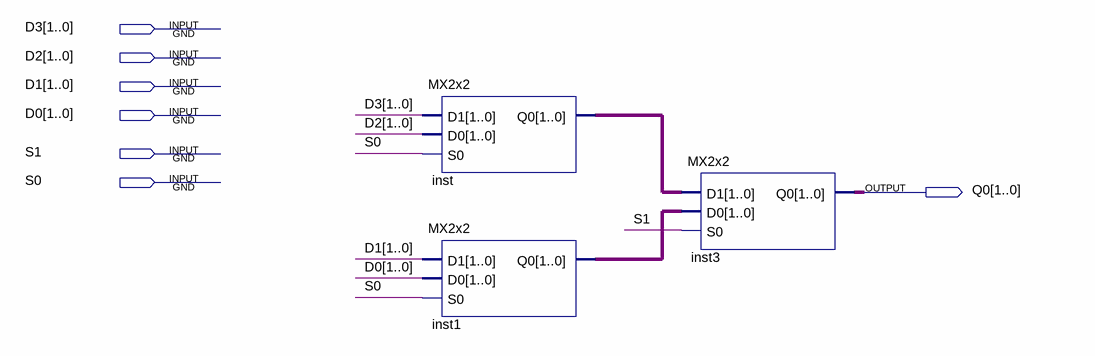
[diagram p0: schematic sheet]
// Quartus schematic MX4x2.bdf as structural Verilog: 3 symbols, 7 pins
module MX4x2 (
  input  [1:0] D3,
  input  [1:0] D2,
  input  [1:0] D1,
  input  [1:0] D0,
  input  S1,
  input  S0,
  output [1:0] Q0
);

  wire [1:0] inst1_q0, inst_q0;

  MX2x2 inst (.D1(D3), .D0(D2), .S0(S0), .Q0(inst_q0));
  MX2x2 inst1 (.D1(D1), .D0(D0), .S0(S0), .Q0(inst1_q0));
  MX2x2 inst3 (.D1(inst_q0), .D0(inst1_q0), .S0(S1), .Q0(Q0));
endmodule
